# Altium project ad_test_pcb1.PrjPCB
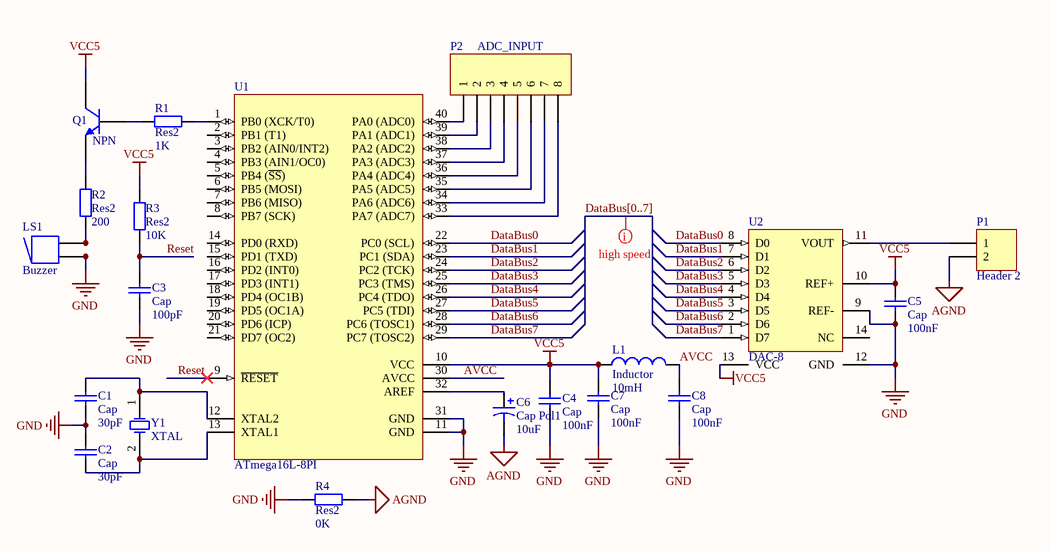
[diagram p0: ad_test_sch1.SchDoc]
1 sheet, 20 parts. Net scope: global (net labels, ports and power ports of the same name join across sheets).
Board file: ad_test_PCB1.PcbDoc

## Sheet ad_test_sch1.SchDoc
size A4

### Parts
C1  Cap  value 30pF  [RAD-0.3]
C2  Cap  value 30pF  [RAD-0.3]
C3  Cap  value 100pF  [RAD-0.3]
C4  Cap  value 100nF  [RAD-0.3]
C5  Cap  value 100nF  [RAD-0.3]
C6  Cap Pol1  value 10uF  [RB7.6-15]
C7  Cap  value 100nF  [RAD-0.3]
C8  Cap  value 100nF  [RAD-0.3]
L1  Inductor  value 10mH  [INDC1608L]
LS1  Buzzer  [ABSM-1574]
P1  Header 2  [HDR1X2]
P2  ADC_INPUT  [HDR1X8H]
Q1  NPN  [TO-226-AA]
R1  Res2  value 1K  [AXIAL-0.4]
R2  Res2  value 200  [AXIAL-0.4]
R3  Res2  value 10K  [AXIAL-0.4]
R4  Res2  value 0K  [AXIAL-0.4]
U1  ATmega16L-8PI  [40P6]
U2  DAC-8  [SOT402-1_N]
Y1  XTAL  [R38]

### Nets
AGND: C6.2 P1.2 R4.2
GND: C1.1 C2.2 C3.1 C4.2 C5.2 C7.2 C8.2 LS1.1 LS1.1A R4.1 U1.11(GND) U1.31(GND) U2.9(REF-) U2.12(GND)
VCC: C4.1 C5.1 C7.1 L1.1 Q1.1(C) R3.2 U1.10(VCC) U2.10(REF+) U2.13(VCC)  [also labelled VCC5]
AVCC: C8.1 L1.2 U1.30(AVCC)
DataBus0: U1.22(PC0_(SCL)) U2.8(D0)
DataBus1: U1.23(PC1_(SDA)) U2.7(D1)
DataBus2: U1.24(PC2_(TCK)) U2.6(D2)
DataBus3: U1.25(PC3_(TMS)) U2.5(D3)
DataBus4: U1.26(PC4_(TDO)) U2.4(D4)
DataBus5: U1.27(PC5_(TDI)) U2.3(D5)
DataBus6: U1.28(PC6_(TOSC1)) U2.2(D6)
DataBus7: U1.29(PC7_(TOSC2)) U2.1(D7)
Reset: C3.2 R3.1 U1.9(~{RESET})
NetC1_2: C1.2 U1.12(XTAL2) Y1.1(OSC1)
NetC2_1: C2.1 U1.13(XTAL1) Y1.2(OSC2)
NetC6_1: C6.1 U1.32(AREF)
NetLS1_2: LS1.2 LS1.2A R2.1
NetP1_1: P1.1 U2.11(VOUT)
NetP2_1: P2.1 U1.40(PA0_(ADC0))
NetP2_2: P2.2 U1.39(PA1_(ADC1))
NetP2_3: P2.3 U1.38(PA2_(ADC2))
NetP2_4: P2.4 U1.37(PA3_(ADC3))
NetP2_5: P2.5 U1.36(PA4_(ADC4))
NetP2_6: P2.6 U1.35(PA5_(ADC5))
NetP2_7: P2.7 U1.34(PA6_(ADC6))
NetP2_8: P2.8 U1.33(PA7_(ADC7))
NetQ1_2: Q1.2(B) R1.2
NetQ1_3: Q1.3(E) R2.2
NetR1_1: R1.1 U1.1(PB0_(XCK/T0))

Not connected (* = marked no-connect by the designer): U1 2(PB1_(T1)) 3(PB2_(AIN0/INT2)) 4(PB3_(AIN1/OC0)) 5(PB4_(~{SS})) 6(PB5_(MOSI)) 7(PB6_(MISO)) 8(PB7_(SCK)) 14(PD0_(RXD)) 15(PD1_(TXD)) 16(PD2_(INT0)) 17(PD3_(INT1)) 18(PD4_(OC1B)) 19(PD5_(OC1A)) 20(PD6_(ICP)) 21(PD7_(OC2)); U2 14(NC)

### Buses and harness runs
bus DataBus[0..7]

### Layout directives
rule Matched Net Lengths [Tolerance = 1000mil]: (no net found under the mark)

### Notes on the sheet
- Title
- Size:
- Date:
- A4
- Number:
- Time:
- Revision:
- Sheet
- of
- File:

### Library data of the parts
C1-C5 C7 C8 = Cap: Capacitor; Published: 8-Jun-2000; LatestRevisionDate: 17-Jul-2002; LatestRevisionNote: Re-released for DXP Platform.; PackageReference: RAD-0.3; Publisher: Altium Limited; PackageDescription: Radial Cap, Thru-Hole; 2 Leads; 0.3 in Pin Spacing
C6 = Cap Pol1: Polarized Capacitor (Radial); Published: 8-Jun-2000; LatestRevisionDate: 17-Jul-2002; LatestRevisionNote: Re-released for DXP Platform.; PackageReference: RB7.6-15; Publisher: Altium Limited; PackageDescription: Polarized Capacitor (Radial); 2 Leads
L1 = Inductor: Code_IEC: 1005; Published: 8-Jun-2000; LatestRevisionDate: 29-May-2009; LatestRevisionNote: IPC-7351 Footprint Added.; PackageReference: 0402-A; Publisher: Altium Limited; PackageDescription: Chip Inductor; Code_JEITA: 0402
LS1 = Buzzer: Magnetic Transducer Buzzer; Published: 24-Mar-1999; LatestRevisionDate: 17-Dec-2003; LatestRevisionNote: Schematic revised, PCB Footprint replaced.; DatasheetVersion: 17-Dec-2003; PackageReference: ABSM-1574; Publisher: Altium Limited; PackageDescription: Magnetic Transducer Buzzer; ComponentLink1Description: Manufacturer Link; ComponentLink1URL: http://www.megastar.com/linecard/buzzmode/index.php
P1 = Header 2: Header, 2-Pin; LatestRevisionDate: 17-Jul-2002; LatestRevisionNote: Re-released for DXP Platform.; Publisher: Altium Limited
P2 = Header 8H: Header, 8-Pin, Right Angle; LatestRevisionDate: 17-Jul-2002; LatestRevisionNote: Re-released for DXP Platform.; Publisher: Altium Limited
Q1 = NPN: NPN Bipolar Transistor; Published: 8-Jun-2000; LatestRevisionDate: 17-Jul-2002; LatestRevisionNote: Re-released for DXP Platform.; PackageReference: TO-226-AA; Publisher: Altium Limited; PackageDescription: TO, Flat Index; 3 In-Line, Axial Leads; Body Dia. 4.8mm; Leads 0.55 x 0.51 mm (max); Code_JEDEC: TO-226-AA
R1-R4 = Res2: Resistor; Published: 8-Jun-2000; LatestRevisionDate: 17-Jul-2002; LatestRevisionNote: Re-released for DXP Platform.; PackageReference: AXIAL-0.4; Publisher: Altium Limited; PackageDescription: Axial Device, Thru-Hole; 2 Leads; 0.4 in Pin Spacing
U1 = ATmega16L-8PI: 8-Bit AVR Microcontroller with 16K Bytes of In-System Programmable Flash Memory; Published: 17-Sep-2003; DatasheetVersion: 2466E-AVR-10/02; PackageVersion: revB, Sep-2001; PackageReference: 40P6; Publisher: Altium Limited; PackageDescription: 40-lead (0.600"/15.24mm Wide) Plastic Dual Inline Package (PDIP); Supplier 1: Digi-Key; Supplier Part Number 1: ATMEGA16L-8PI-ND; Supplier 2: Mouser; Supplier Part Number 2: 556-ATMEGA16L-8PI; Code_JEDEC: MS-011-AC; ComponentLink1Description: Datasheet; ComponentLink1URL: http://www.atmel.com/dyn/resources/prod_documents/doc2466.pdf; ComponentLink2Description: Atmel.com Home; ComponentLink2URL: http://www.atmel.com
U2 = DAC-8: Generic 8-Bit D/A Converter; Published: 8-Jun-2000; LatestRevisionDate: 29-May-2009; LatestRevisionNote: IPC-7351 Footprint Added.; PackageVersion: Mar-2002; PackageReference: SOT402-1; Publisher: Altium Limited; PackageDescription: 14-Pin Thin Small Outline Package 0.65 mm Pitch; Code_JEDEC: MO-153
Y1 = XTAL: Crystal Oscillator; Published: 8-Jun-2000; LatestRevisionDate: 17-Jul-2002; LatestRevisionNote: Re-released for DXP Platform.; PackageReference: R38; Publisher: Altium Limited; PackageDescription: Crystal, Thru-Hole; 2 Leads; Body 3.1 x 8.2 mm (Dia.xH)